# Altium schematic sheet Communication.SchDoc
size A4; SheetNumber: 4; SheetTotal: 6
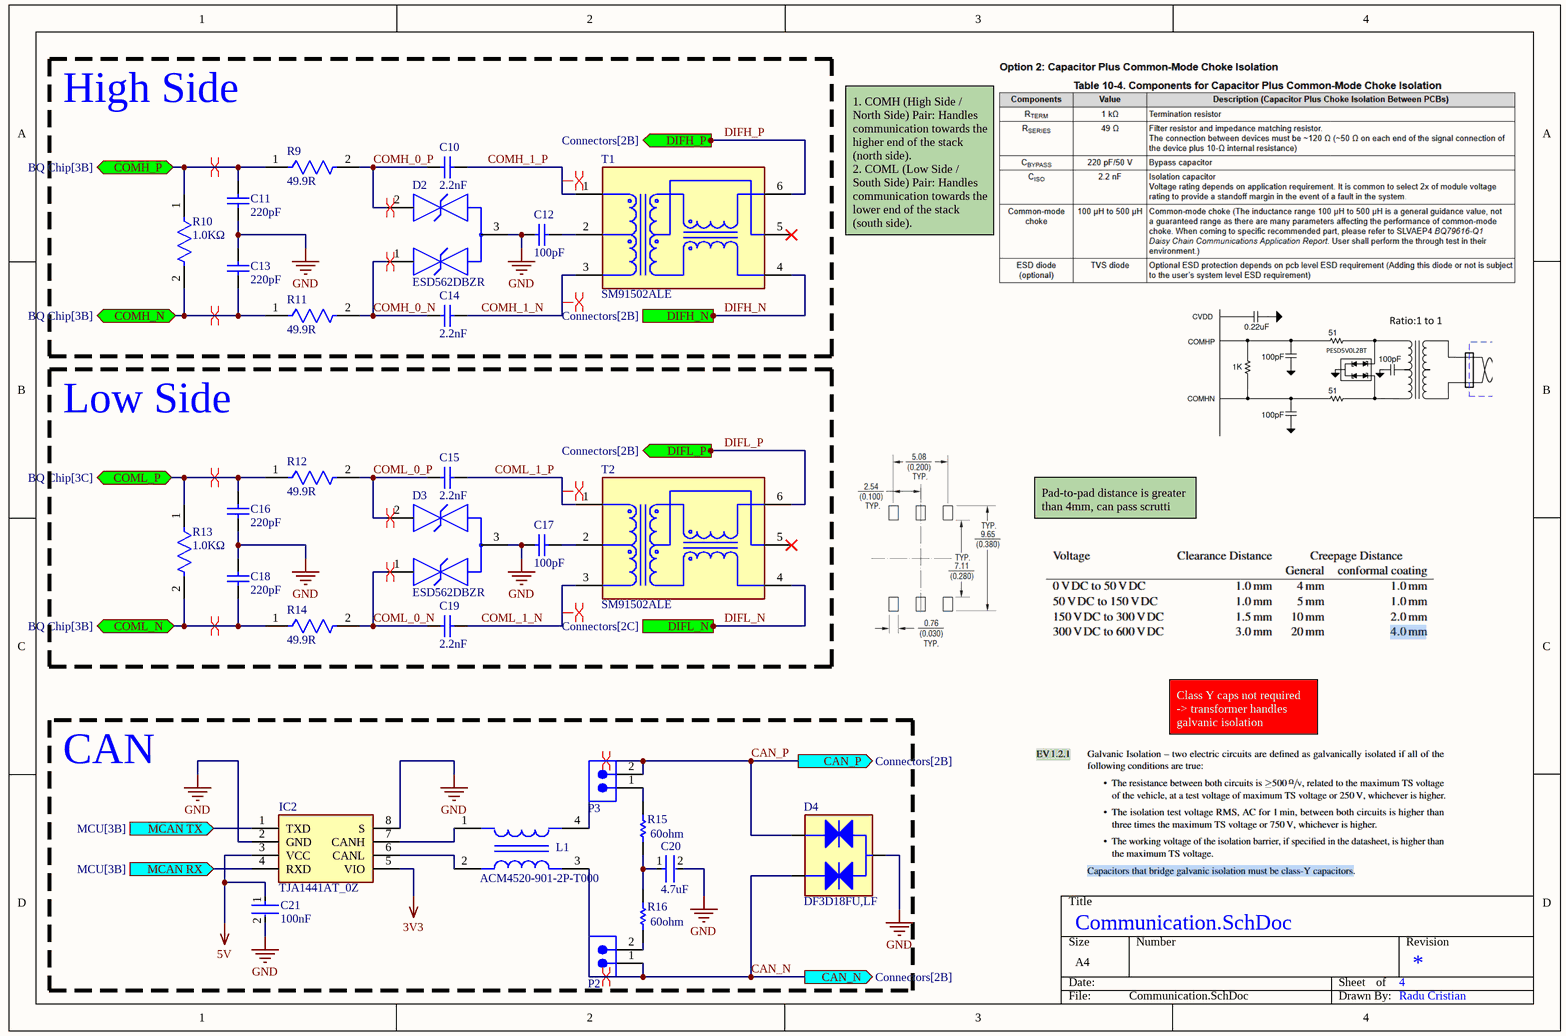
[diagram p0: Communication.SchDoc]

## Parts
C10  Parameter 1: 2.2nF  [CAPC1608X92X38ML15T08]  (hidden comment: VJ0603Y222JXBAC)
C11  value 220pF  [CAPC0603(1608)100_N]  (hidden comment: CAP 220pF 100V 0603(1608))
C12  Parameter 1: 100pF  [CAPC1608X90X35NL15T15]  (hidden comment: 06031A101J4T2A)
C13  value 220pF  [CAPC0603(1608)100_N]  (hidden comment: CAP 220pF 100V 0603(1608))
C14  Parameter 1: 2.2nF  [CAPC1608X92X38ML15T08]  (hidden comment: VJ0603Y222JXBAC)
C15  Parameter 1: 2.2nF  [CAPC1608X92X38ML15T08]  (hidden comment: VJ0603Y222JXBAC)
C16  value 220pF  [CAPC0603(1608)100_N]  (hidden comment: CAP 220pF 100V 0603(1608))
C17  Parameter 1: 100pF  [CAPC1608X90X35NL15T15]  (hidden comment: 06031A101J4T2A)
C18  value 220pF  [CAPC0603(1608)100_N]  (hidden comment: CAP 220pF 100V 0603(1608))
C19  Parameter 1: 2.2nF  [CAPC1608X92X38ML15T08]  (hidden comment: VJ0603Y222JXBAC)
C20  value 4.7uF  [FP-C0603C-CF-MFG]  (hidden comment: C0603C472J5RACTU)
C21  Capacitance: 100nF  [FP-CC0603-DA-IPC_A]  (hidden comment: CC0603JRX7R9BB104)
D2  ESD562DBZR  [FP-DBZ0003A-MFG]
D3  ESD562DBZR  [FP-DBZ0003A-MFG]
D4  DF3D18FU,LF  [SOT23-3]
IC2  TJA1441AT_0Z  [SOIC127P600X175-8N]
L1  ACM4520-901-2P-T000  [FP-ACM4520-MFG]
P2  62000211121  [62000211121]  (value not drawn)
P3  62000211121  [62000211121]  (value not drawn)
R9  Resistance: 49.9R  [FP-CRCW0603-HPe3-MFG]  (hidden comment: CRCW060349R9FKECHP)
R10  Resistance: 1.0KΩ  [FP-CPF0603-IPC_C]  (hidden comment: CPF0603F1K0C1)
R11  Resistance: 49.9R  [FP-CRCW0603-HPe3-MFG]  (hidden comment: CRCW060349R9FKECHP)
R12  Resistance: 49.9R  [FP-CRCW0603-HPe3-MFG]  (hidden comment: CRCW060349R9FKECHP)
R13  Resistance: 1.0KΩ  [FP-CPF0603-IPC_C]  (hidden comment: CPF0603F1K0C1)
R14  Resistance: 49.9R  [FP-CRCW0603-HPe3-MFG]  (hidden comment: CRCW060349R9FKECHP)
R15  Parameter 1: 60ohm  [RESC1608X55X30LL20T20]  (hidden comment: ERA3AEB620V)
R16  Parameter 1: 60ohm  [RESC1608X55X30LL20T20]  (hidden comment: ERA3AEB620V)
T1  SM91502ALE  [FP-SM91502ALE-MFG]
T2  SM91502ALE  [FP-SM91502ALE-MFG]

## Blocks framed on the sheet
High Side: C10-C14 D2 R9-R11 T1
Low Side: C15-C19 D3 R12-R14 T2
CAN: C20 C21 D4 IC2 L1 P2 P3 R15 R16

## Ports
CAN_N (out, see Connectors[2B]), CAN_P (out, see Connectors[2B]), COMH_N (bidir, see BQ Chip[3B]), COMH_P (bidir, see BQ Chip[3B]), COML_N (bidir, see BQ Chip[3B]), COML_P (bidir, see BQ Chip[3C]), DIFH_N (out, see Connectors[2B]), DIFH_P (out, see Connectors[2B]), DIFL_N (out, see Connectors[2C]), DIFL_P (out, see Connectors[2B]), MCAN RX (in, see MCU[3B]), MCAN TX (in, see MCU[3B])

## Nets
3V3: IC2.5(VIO)
5V: C21.1 IC2.3(VCC)
GND: C11.2 C12.1 C13.1 C16.2 C17.1 C18.1 C20.2 C21.2 D2.3(GND) D3.3(GND) D4.3 IC2.2(GND) IC2.8(S)
CAN_N: D4.1 L1.3 P2.1 ; port CAN_N
CAN_P: D4.2 L1.4 P3.2 ; port CAN_P
COMH_0_N: C14.2 D2.1(1_IO) R11.2
COMH_0_P: C10.2 D2.2(2_IO) R9.2
COMH_1_N: C14.1 T1.3
COMH_1_P: C10.1 T1.1
COMH_N: C13.2 R10.2 R11.1 ; port COMH_N
COMH_P: C11.1 R9.1 R10.1 ; port COMH_P
COML_0_N: C19.2 D3.1(1_IO) R14.2
COML_0_P: C15.2 D3.2(2_IO) R12.2
COML_1_N: C19.1 T2.3
COML_1_P: C15.1 T2.1
COML_N: C18.2 R13.2 R14.1 ; port COML_N
COML_P: C16.1 R12.1 R13.1 ; port COML_P
DIFH_N: T1.4 ; port DIFH_N
DIFH_P: T1.6 ; port DIFH_P
DIFL_N: T2.4 ; port DIFL_N
DIFL_P: T2.6 ; port DIFL_P
MCAN RX: IC2.4(RXD) ; port MCAN RX
MCAN TX: IC2.1(TXD) ; port MCAN TX
NetC12_2: C12.2 T1.2
NetC17_2: C17.2 T2.2
NetC20_1: C20.1 R15.1 R16.2
NetIC2_6: IC2.6(CANL) L1.2
NetIC2_7: IC2.7(CANH) L1.1
NetP2_2: P2.2 R16.1
NetP3_1: P3.1 R15.2

Not connected (* = marked no-connect by the designer): T1 5*; T2 5*

## Layout directives
differential pair: CAN_N, CAN_P, COMH_0_N, COMH_0_P, COMH_1_N, COMH_1_P, COMH_N, COMH_P, COML_0_N, COML_0_P, COML_1_N, COML_1_P, COML_N, COML_P

## Notes on the sheet
- 1. COMH (High Side / North Side) Pair: Handles communication towards the higher end of the stack (north side).
  2. COML (Low Side / South Side) Pair: Handles communication towards the lower end of the stack (south side).
- Pad-to-pad distance is greater than 4mm, can pass scrutti
- Class Y caps not required -> transformer handles galvanic isolation
- Radu Cristian

## Library data of the parts
C10 C14 C15 C19 = CMP-2006-01264-1: Manufacturer: Vitramon; Part Number: VJ0603Y222JXBAC
C11 C13 C16 C18 = CMP-1035-01477-1: CAP 220pF 100V ±10% 0603 (1608 Metric) Thickness 1mm SMD; Tolerance: Â±10%; Case-EIA: 0603; Case-Metric: 1608; Rated Voltage: 100 V; Max Thickness: 1 mm; Technology: SMT
C12 C17 = CMP-2006-04571-1: Manufacturer: AVX Interconnect / Elco; Part Number: 06031A101J4T2A
C20 = CMP-1035-02202-3: C0603C 4.7nF Ceramic Multilayer Capacitor; 50 VDC; +125degC; X7R Dielec; +/-5%; Manufacturer: KEMET; Tolerance: 0.05; Capacitance: 4,700 pF; Temperature Coefficient: 30ppm/°C; Automotive Grade: Grade 1; Voltage Rating: 50 V; Device Class L2: Capacitors; Temperature Range Low: -55°C; Automotive: Yes; Manufacturer Part Number: C0603C472J5RACTU; Height: 0.87mm; ComponentLink2Description: Datasheet; Mouser Description: Multilayer Ceramic Capacitors MLCC - SMD/SMT 50volts 4700pF X7R 5%; Material: Ceramic; Device Class L3: Ceramic Capacitors; Device Class L1: Passive Components; Category: Cap; Temperature: -55°C to +125°C; Octopart: https://octopart.com/c0603c472j5ractu-kemet-107195; Digikey Description: C0603C 4.7nF Ceramic Multilayer Capacitor; 50 VDC; +125degC; X7R Dielec; +/-5%; Package: C0603C-CF; Lead Free: Yes; RoHS: TRUE; ComponentLink2URL: https://api.kemet.com/component-edge/download/datasheet/C0603C100J5GACAUTO.pdf; Temperature Range High: +125°C; Temperature Characteristic: X7R
C21 = CMP-03422-001490-1: CAP CER 0.1UF 50V X7R 0603; Tolerance: 5%; Number of Pins: 2; Depth: 0.8mm; Weight: 7.1E-05oz; Radiation Hardening: No; Case Code (Metric): 1608; Dielectric: X7R; Max Operating Temperature: 125°C; Voltage Rating (DC): 50V; Case/Package: 0603; Halogen Free: Halogen Free; Mount: Surface Mount; Lead Free: Lead Free; Termination: SMD/SMT; RoHS Compliant: Yes; Length: 1.6mm; Series: CC; Resistor Type: Ceramic; Case Code (Imperial): 0603; Construction: Flat; Width: 0.031inch; Height: 0.8mm; Voltage Rating: 50V; Min Operating Temperature: -55°C; Thickness: 0.035inch; Packaging: Tape and Reel
D2 D3 = CMP-00370-147404550-1: ESD562DBZR Two-channel bidirectional 12V ESD protection diode 3-SOT-23 -40 to 125; Manufacturer Lifecycle Status: ACTIVE; NexarPartId: 147404550; Thickness: 1mm; Length: 2.92mm; Number of Pins: 3; Height: 1.22mm; Lifecycle Status: Production; Width: 1.3mm; Case/Package: SOT-23
D4 = DF3D18FU,LF: ESD Suppressors / TVS Diodes ESD Protection Diode Bi-directional type; Manufacturer: Toshiba; Breakdown Voltage: 18.35V; Clamping Voltage: 33V; Max Breakdown Voltage: 20.5V; Min Breakdown Voltage: 16.2V; Number of Bidirectional Channels: 2; Peak Pulse Current: 2.5A; Peak Pulse Power: 80W; Peak Reverse Current: 100nA; Polarity: Bidirectional; Power Line Protection: No; Reverse Standoff Voltage: 12V; Supplier: DigiKey; Supplier Part Number: DF3D18FULFCT-ND; Manufacturer Part Number: DF3D18FU,LF; RoHS: Compliant; Category: TVS Diodes; Stock: 17327; Pricing: 1=0.38, 10=0.254, 100=0.172, 500=0.133, 1000=0.113 (USD); Contact Plating: Tin; Lifecycle Status: Production; Max Operating Temperature: 150°C; Mounting Technology: Surface Mount; Number of Elements: 2; Number of Terminals: 3; REACH SVHC: Yes; ComponentLink1URL: https://datasheet.octopart.com:443/DF3D18FU%2CLF-Toshiba-datasheet-181389782.pdf?src-supplier=IHS; ComponentLink1Description: https://datasheet.octopart.com:443/DF3D18FU%2CLF-Toshiba-datasheet-181389782.pdf?src-supplier=IHS; Supplier 1: Mouser; Supplier Part Number 1: 757-DF3D18FULF
IC2 = TJA1441AT_0Z: Integrated Circuit; Manufacturer_Name: NXP; Manufacturer_Part_Number: TJA1441AT/0Z; Datasheet Link: https://www.mouser.it/datasheet/2/302/TJA1441-1949304.pdf; Height: 1.75mm; Mouser Part Number: 771-TJA1441AT/0Z; Mouser Price/Stock: https://www.mouser.co.uk/ProductDetail/NXP-Semiconductors/TJA1441AT-0Z?qs=eP2BKZSCXI7fcqmlBnmIFw%3D%3D; Arrow Part Number: TJA1441AT/0Z; Arrow Price/Stock: https://www.arrow.com/en/products/tja1441at0z/nxp-semiconductors?region=nac
L1 = CMP-2000-05389-2: CMC 2.3A 2LN 900 OHM SMD; Max Current Rating: 2A; Number of Lines: 2; Impedance: 900R; Element Configuration: Dual; Insulation Resistance: 10MR; Test Frequency: 100MHz; DC Resistance (DCR): 60mR; Voltage Rating (DC): 50V; Number of Pins: 4; DC Current: 2A; Mount: Surface Mount; Current: 2A; REACH SVHC: No SVHC; Width: 4.5mm; Case/Package: 1808; Current Rating: 2.3A; Voltage Rating: 50V; Package Quantity: 1; Height: 2mm; Max DC Current: 2A; Packaging: Tape and Reel; Max Operating Temperature: 85°C; Lead Free: Lead Free; Length: 0.185inch; Series: ACM; Radiation Hardening: No; Max Voltage Rating (DC): 50V; Termination: Flat; Depth: 4.7mm; RoHS Compliant: Yes; DC Resistance-Max: 60mR; Min Operating Temperature: -40°C
P2 P3 = CMP-1502-00956-4: NexarPartId: 61924778; Current Rating: 2A; Operating Supply Voltage: 200V; Contact Resistance: 20mΩ; Number of Contacts: 2; Gender: Male; RoHS: Non-Compliant; Max Operating Temperature: 105°C; Voltage Rating: 200V; Contact Material: Gold; Height: 6.35mm; Number of Rows: 1; Lead Pitch: 2mm; Min Operating Temperature: -40°C; Number of Pins: 2; Orientation: Vertical
R9 R11 R12 R14 = CMP-02407-009504-1: RES Thick Film, 49.9Ω, 1%, 0.33W, 100ppm/°C, 0603; Power Rating: 100mW; Tolerance: 1%; Case/Package: 0603; Lead Free: Lead Free
R10 R13 = CMP-03211-002621-1: RES SMD 1.0KΩ 1% 1/16W 0603; Manufacturer: TE Connectivity; Power Rating: 0.063W; Voltage Rating: 50V; Temperature Coefficient: 50ppm/°C; Octopart: https://octopart.com/cpf0603f1k0c1-te+connectivity-42013134; packaging: 1k Reel; Category: Res; Device Class L3: Chip SMD Resistors; octopart_url: https://octopart.com/cpf0603f1k0c1-te+connectivity-42013134; Value: 1.0KΩ; Temperature: -55°C to +155°C; Composition: Thin Film; ComponentLink2URL: https://www.te.com/commerce/DocumentDelivery/DDEController?Action=showdoc&DocId=Data+Sheet%7F1773200%7FM%7Fpdf%7FEnglish%7FENG_DS_1773200_M.pdf%7F3-1676481-2; Tolerance: 1%; Automotive: No; Lead Free: Yes; Height: 0.55mm; Device Class L1: Passive Components; Device Class L2: Resistors; Ipc Land Pattern Name: RESC15580X45; Series: CPF; ComponentLink2Description: Datasheet; RoHS: TRUE; Package: CPF0603; Manufacturer Part Number: CPF0603F1K0C1; Temperature Range Low: -55°C; Temperature Range High: +155°C
R15 R16 = CMP-2000-00102-1: Manufacturer: Panasonic; Part Number: ERA3AEB620V
T1 T2 = CMP-07264-000001-1: BMS XFORMER 1-CH 1000V AECQ +125; Manufacturer: Bourns; Standoff Height: 0.13mm; Turns Ratio: 1:1; Automotive Grade: Grade 1; Isolation Voltage: 4300VDC; Return Loss: -22dB; Insertion Loss: -0.25dB; Height: 5.72mm; Automotive: Yes; Package: 0; Device Class L3: unset; ComponentLink2Description: Datasheet; Category: Trans; ComponentLink2URL: https://www.bourns.com/docs/product-datasheets/SM91502AL.pdf; Device Class L1: Passive Components; Manufacturer Part Number: SM91502ALE; Temperature Range High: +125°C; Digikey Description: BMS XFORMER 1-CH 1000V AECQ +125; RoHS: TRUE; Lead Free: Yes; Octopart: https://octopart.com/sm91502ale-bourns-95732123; Device Class L2: Transformers; Temperature: -40°C to +125°C; Temperature Range Low: -40°C